# Altium schematic sheet 3V7_to_3V3_LDO.SchDoc
size A; SheetNumber: 3; SheetTotal: 15
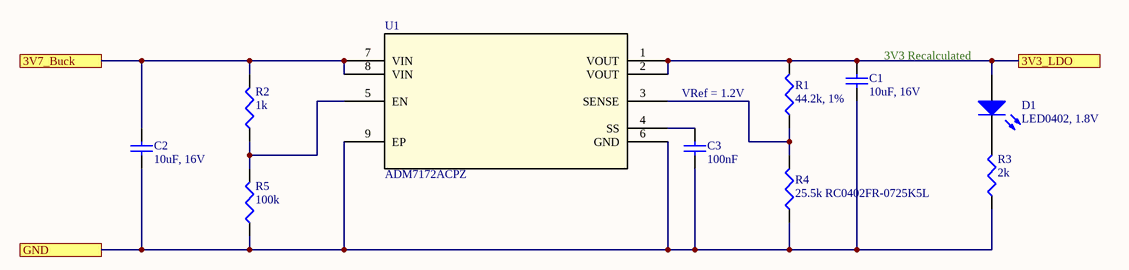
[diagram p0: 3V7_to_3V3_LDO.SchDoc]

## Parts
C1  10uF, 16V  [SMD-0603]
C2  10uF, 16V  [SMD-0603]
C3  100nF  [SMD-0402]
D1  LED0402, 1.8V  [LED-0402]
R1  44.2k, 1%  [SMD-0402]
R2  1k  [SMD-0402]
R3  2k  [SMD-0402]
R4  25.5k RC0402FR-0725K5L  [SMD-0402]
R5  100k  [SMD-0402]
U1  ADM7172ACPZ  [ADM7172_VIA_NOSILK]

## Ports
3V3_LDO (see IQ_Mod[5D]), 3V7_Buck (see IQ_Mod[4D], Clocking_and_LO[1B], LMX2820[3B]), GND (see IQ_Mod[4D], 5V5_to_5V0_LDO[1C], Buck_TPSM82913_1V8[3C], Buck_TPSM82913_3V7[3C], Buck_TPSM82913_5V0[3C], Buck_TPSM82913_5V5[2C], Clocking_and_LO[2A], Fan_Interfaces[2B], IQ_Demod[1C], IQ_Mod[1B], LMX2820[4D], Microzed_Interfaces[1A], Power_Supply[6B], Voltage_Conv_Bidirectional[1B])

## Nets
3V3_LDO: C1.2 D1.1(A) R1.2 U1.1(VOUT) U1.2(VOUT) ; port 3V3_LDO
3V7_Buck: C2.2 R2.2 U1.7(VIN) U1.8(VIN) ; port 3V7_Buck
GND: C1.1 C2.1 C3.1 R3.1 R4.1 R5.1 U1.6(GND) U1.9(EP) ; port GND
NetC3_2: C3.2 U1.4(SS)
NetD1_2: D1.2(K) R3.2
NetR1_1: R1.1 R4.2 U1.3(SENSE)
NetR2_1: R2.1 R5.2 U1.5(EN)

## Notes on the sheet
- 3V3 Recalculated
- VRef = 1.2V

## Library data of the parts
C1 C2 = CAP0603: Ceramic Capacitor 0603
C3 = CAP0402: Ceramic Capacitor 0402
D1 = LED0402: LED 0402
R1-R5 = RES0402: Resistor-0402
U1 = ADM7172ACPZ: 6.5V, 2A, Ultralow Noise, High PSRR, Fast Transient Response CMOS LDO; Value: Value; Type: Type; RefDes: RefDes